# Altium schematic sheet DAC_SW_LEFT.SchDoc
size 381 x 241 mm
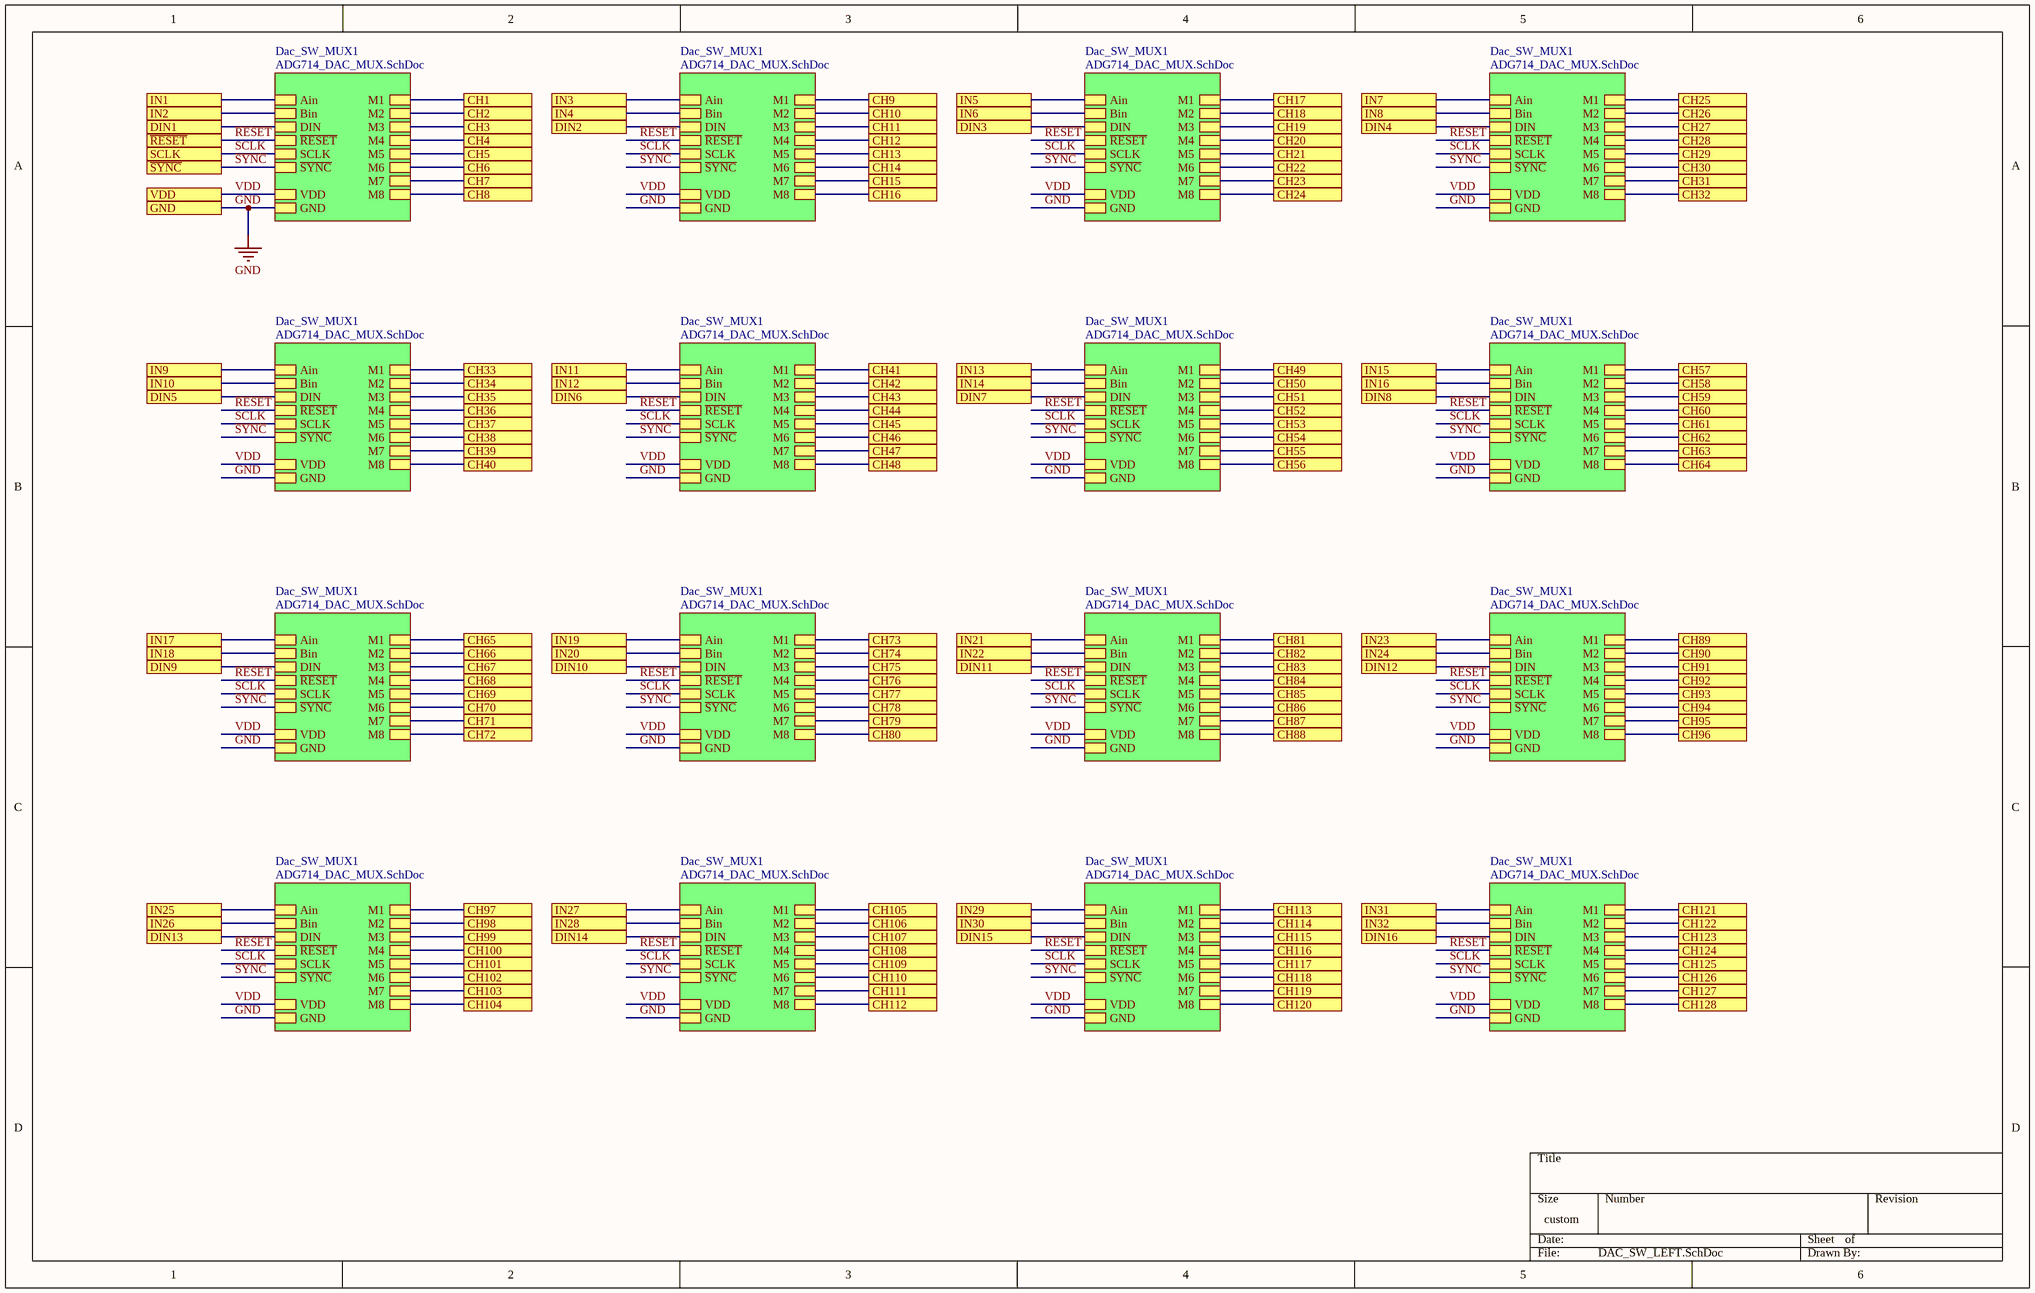
[diagram p0: DAC_SW_LEFT.SchDoc]

## Sub-sheets
Dac_SW_MUX1 = ADG714_DAC_MUX.SchDoc: M2, M7, M1, M6, M3, Bin, M5, VDD, GND, Ain, M8, M4, SCLK, ~{SYNC}, ~{RESET}, DIN
Dac_SW_MUX1 = ADG714_DAC_MUX.SchDoc: M2, M7, M1, M6, M3, Bin, M5, VDD, GND, Ain, M8, M4, SCLK, ~{SYNC}, ~{RESET}, DIN
Dac_SW_MUX1 = ADG714_DAC_MUX.SchDoc: M2, M7, M1, M6, M3, Bin, M5, VDD, GND, Ain, M8, M4, SCLK, ~{SYNC}, ~{RESET}, DIN
Dac_SW_MUX1 = ADG714_DAC_MUX.SchDoc: M2, M7, M1, M6, M3, Bin, M5, VDD, GND, Ain, M8, M4, SCLK, ~{SYNC}, ~{RESET}, DIN
Dac_SW_MUX1 = ADG714_DAC_MUX.SchDoc: M2, M7, M1, M6, M3, Bin, M5, VDD, GND, Ain, M8, M4, SCLK, ~{SYNC}, ~{RESET}, DIN
Dac_SW_MUX1 = ADG714_DAC_MUX.SchDoc: M2, M7, M1, M6, M3, Bin, M5, VDD, GND, Ain, M8, M4, SCLK, ~{SYNC}, ~{RESET}, DIN
Dac_SW_MUX1 = ADG714_DAC_MUX.SchDoc: M2, M7, M1, M6, M3, Bin, M5, VDD, GND, Ain, M8, M4, SCLK, ~{SYNC}, ~{RESET}, DIN
Dac_SW_MUX1 = ADG714_DAC_MUX.SchDoc: M2, M7, M1, M6, M3, Bin, M5, VDD, GND, Ain, M8, M4, SCLK, ~{SYNC}, ~{RESET}, DIN
Dac_SW_MUX1 = ADG714_DAC_MUX.SchDoc: M2, M7, M1, M6, M3, Bin, M5, VDD, GND, Ain, M8, M4, SCLK, ~{SYNC}, ~{RESET}, DIN
Dac_SW_MUX1 = ADG714_DAC_MUX.SchDoc: M2, M7, M1, M6, M3, Bin, M5, VDD, GND, Ain, M8, M4, SCLK, ~{SYNC}, ~{RESET}, DIN
Dac_SW_MUX1 = ADG714_DAC_MUX.SchDoc: M2, M7, M1, M6, M3, Bin, M5, VDD, GND, Ain, M8, M4, SCLK, ~{SYNC}, ~{RESET}, DIN
Dac_SW_MUX1 = ADG714_DAC_MUX.SchDoc: M2, M7, M1, M6, M3, Bin, M5, VDD, GND, Ain, M8, M4, SCLK, ~{SYNC}, ~{RESET}, DIN
Dac_SW_MUX1 = ADG714_DAC_MUX.SchDoc: M2, M7, M1, M6, M3, Bin, M5, VDD, GND, Ain, M8, M4, SCLK, ~{SYNC}, ~{RESET}, DIN
Dac_SW_MUX1 = ADG714_DAC_MUX.SchDoc: M2, M7, M1, M6, M3, Bin, M5, VDD, GND, Ain, M8, M4, SCLK, ~{SYNC}, ~{RESET}, DIN
Dac_SW_MUX1 = ADG714_DAC_MUX.SchDoc: M2, M7, M1, M6, M3, Bin, M5, VDD, GND, Ain, M8, M4, SCLK, ~{SYNC}, ~{RESET}, DIN
Dac_SW_MUX1 = ADG714_DAC_MUX.SchDoc: M2, M7, M1, M6, M3, Bin, M5, VDD, GND, Ain, M8, M4, SCLK, ~{SYNC}, ~{RESET}, DIN

## Ports
CH1, CH2, CH3, CH4, CH5, CH6, CH7, CH8, CH9, CH10, CH11, CH12, CH13, CH14, CH15, CH16, CH17, CH18, CH19, CH20, CH21, CH22, CH23, CH24, CH25, CH26, CH27, CH28, CH29, CH30, CH31, CH32, CH33, CH34, CH35, CH36, CH37, CH38, CH39, CH40, CH41, CH42, CH43, CH44, CH45, CH46, CH47, CH48, CH49, CH50, CH51, CH52, CH53, CH54, CH55, CH56, CH57, CH58, CH59, CH60, CH61, CH62, CH63, CH64, CH65, CH66, CH67, CH68, CH69, CH70, CH71, CH72, CH73, CH74, CH75, CH76, CH77, CH78, CH79, CH80, CH81, CH82, CH83, CH84, CH85, CH86, CH87, CH88, CH89, CH90, CH91, CH92, CH93, CH94, CH95, CH96, CH97, CH98, CH99, CH100, CH101, CH102, CH103, CH104, CH105, CH106, CH107, CH108, CH109, CH110, CH111, CH112, CH113, CH114, CH115, CH116, CH117, CH118, CH119, CH120, CH121, CH122, CH123, CH124, CH125, CH126, CH127, CH128, DIN1, DIN2, DIN3, DIN4, DIN5, DIN6, DIN7, DIN8, DIN9, DIN10, DIN11, DIN12, DIN13, DIN14, DIN15, DIN16, GND, IN1, IN2, IN3, IN4, IN5, IN6, IN7, IN8, IN9, IN10, IN11, IN12, IN13, IN14, IN15, IN16, IN17, IN18, IN19, IN20, IN21, IN22, IN23, IN24, IN25, IN26, IN27, IN28, IN29, IN30, IN31, IN32, SCLK, VDD, ~{RESET}, ~{SYNC}

## Nets
GND: port GND, sheet Dac_SW_MUX1/GND, sheet Dac_SW_MUX1/GND, sheet Dac_SW_MUX1/GND, sheet Dac_SW_MUX1/GND, sheet Dac_SW_MUX1/GND, sheet Dac_SW_MUX1/GND, sheet Dac_SW_MUX1/GND, sheet Dac_SW_MUX1/GND, sheet Dac_SW_MUX1/GND, sheet Dac_SW_MUX1/GND, sheet Dac_SW_MUX1/GND, sheet Dac_SW_MUX1/GND, sheet Dac_SW_MUX1/GND, sheet Dac_SW_MUX1/GND, sheet Dac_SW_MUX1/GND, sheet Dac_SW_MUX1/GND
CH1: port CH1, sheet Dac_SW_MUX1/M1
CH2: port CH2, sheet Dac_SW_MUX1/M2
CH3: port CH3, sheet Dac_SW_MUX1/M3
CH4: port CH4, sheet Dac_SW_MUX1/M4
CH5: port CH5, sheet Dac_SW_MUX1/M5
CH6: port CH6, sheet Dac_SW_MUX1/M6
CH7: port CH7, sheet Dac_SW_MUX1/M7
CH8: port CH8, sheet Dac_SW_MUX1/M8
CH9: port CH9, sheet Dac_SW_MUX1/M1
CH10: port CH10, sheet Dac_SW_MUX1/M2
CH11: port CH11, sheet Dac_SW_MUX1/M3
CH12: port CH12, sheet Dac_SW_MUX1/M4
CH13: port CH13, sheet Dac_SW_MUX1/M5
CH14: port CH14, sheet Dac_SW_MUX1/M6
CH15: port CH15, sheet Dac_SW_MUX1/M7
CH16: port CH16, sheet Dac_SW_MUX1/M8
CH17: port CH17, sheet Dac_SW_MUX1/M1
CH18: port CH18, sheet Dac_SW_MUX1/M2
CH19: port CH19, sheet Dac_SW_MUX1/M3
CH20: port CH20, sheet Dac_SW_MUX1/M4
CH21: port CH21, sheet Dac_SW_MUX1/M5
CH22: port CH22, sheet Dac_SW_MUX1/M6
CH23: port CH23, sheet Dac_SW_MUX1/M7
CH24: port CH24, sheet Dac_SW_MUX1/M8
CH25: port CH25, sheet Dac_SW_MUX1/M1
CH26: port CH26, sheet Dac_SW_MUX1/M2
CH27: port CH27, sheet Dac_SW_MUX1/M3
CH28: port CH28, sheet Dac_SW_MUX1/M4
CH29: port CH29, sheet Dac_SW_MUX1/M5
CH30: port CH30, sheet Dac_SW_MUX1/M6
CH31: port CH31, sheet Dac_SW_MUX1/M7
CH32: port CH32, sheet Dac_SW_MUX1/M8
CH33: port CH33, sheet Dac_SW_MUX1/M1
CH34: port CH34, sheet Dac_SW_MUX1/M2
CH35: port CH35, sheet Dac_SW_MUX1/M3
CH36: port CH36, sheet Dac_SW_MUX1/M4
CH37: port CH37, sheet Dac_SW_MUX1/M5
CH38: port CH38, sheet Dac_SW_MUX1/M6
CH39: port CH39, sheet Dac_SW_MUX1/M7
CH40: port CH40, sheet Dac_SW_MUX1/M8
CH41: port CH41, sheet Dac_SW_MUX1/M1
CH42: port CH42, sheet Dac_SW_MUX1/M2
CH43: port CH43, sheet Dac_SW_MUX1/M3
CH44: port CH44, sheet Dac_SW_MUX1/M4
CH45: port CH45, sheet Dac_SW_MUX1/M5
CH46: port CH46, sheet Dac_SW_MUX1/M6
CH47: port CH47, sheet Dac_SW_MUX1/M7
CH48: port CH48, sheet Dac_SW_MUX1/M8
CH49: port CH49, sheet Dac_SW_MUX1/M1
CH50: port CH50, sheet Dac_SW_MUX1/M2
CH51: port CH51, sheet Dac_SW_MUX1/M3
CH52: port CH52, sheet Dac_SW_MUX1/M4
CH53: port CH53, sheet Dac_SW_MUX1/M5
CH54: port CH54, sheet Dac_SW_MUX1/M6
CH55: port CH55, sheet Dac_SW_MUX1/M7
CH56: port CH56, sheet Dac_SW_MUX1/M8
CH57: port CH57, sheet Dac_SW_MUX1/M1
CH58: port CH58, sheet Dac_SW_MUX1/M2
CH59: port CH59, sheet Dac_SW_MUX1/M3
CH60: port CH60, sheet Dac_SW_MUX1/M4
CH61: port CH61, sheet Dac_SW_MUX1/M5
CH62: port CH62, sheet Dac_SW_MUX1/M6
CH63: port CH63, sheet Dac_SW_MUX1/M7
CH64: port CH64, sheet Dac_SW_MUX1/M8
CH65: port CH65, sheet Dac_SW_MUX1/M1
CH66: port CH66, sheet Dac_SW_MUX1/M2
CH67: port CH67, sheet Dac_SW_MUX1/M3
CH68: port CH68, sheet Dac_SW_MUX1/M4
CH69: port CH69, sheet Dac_SW_MUX1/M5
CH70: port CH70, sheet Dac_SW_MUX1/M6
CH71: port CH71, sheet Dac_SW_MUX1/M7
CH72: port CH72, sheet Dac_SW_MUX1/M8
CH73: port CH73, sheet Dac_SW_MUX1/M1
CH74: port CH74, sheet Dac_SW_MUX1/M2
CH75: port CH75, sheet Dac_SW_MUX1/M3
CH76: port CH76, sheet Dac_SW_MUX1/M4
CH77: port CH77, sheet Dac_SW_MUX1/M5
CH78: port CH78, sheet Dac_SW_MUX1/M6
CH79: port CH79, sheet Dac_SW_MUX1/M7
CH80: port CH80, sheet Dac_SW_MUX1/M8
CH81: port CH81, sheet Dac_SW_MUX1/M1
CH82: port CH82, sheet Dac_SW_MUX1/M2
CH83: port CH83, sheet Dac_SW_MUX1/M3
CH84: port CH84, sheet Dac_SW_MUX1/M4
CH85: port CH85, sheet Dac_SW_MUX1/M5
CH86: port CH86, sheet Dac_SW_MUX1/M6
CH87: port CH87, sheet Dac_SW_MUX1/M7
CH88: port CH88, sheet Dac_SW_MUX1/M8
CH89: port CH89, sheet Dac_SW_MUX1/M1
CH90: port CH90, sheet Dac_SW_MUX1/M2
CH91: port CH91, sheet Dac_SW_MUX1/M3
CH92: port CH92, sheet Dac_SW_MUX1/M4
CH93: port CH93, sheet Dac_SW_MUX1/M5
CH94: port CH94, sheet Dac_SW_MUX1/M6
CH95: port CH95, sheet Dac_SW_MUX1/M7
CH96: port CH96, sheet Dac_SW_MUX1/M8
CH97: port CH97, sheet Dac_SW_MUX1/M1
CH98: port CH98, sheet Dac_SW_MUX1/M2
CH99: port CH99, sheet Dac_SW_MUX1/M3
CH100: port CH100, sheet Dac_SW_MUX1/M4
CH101: port CH101, sheet Dac_SW_MUX1/M5
CH102: port CH102, sheet Dac_SW_MUX1/M6
CH103: port CH103, sheet Dac_SW_MUX1/M7
CH104: port CH104, sheet Dac_SW_MUX1/M8
CH105: port CH105, sheet Dac_SW_MUX1/M1
CH106: port CH106, sheet Dac_SW_MUX1/M2
CH107: port CH107, sheet Dac_SW_MUX1/M3
CH108: port CH108, sheet Dac_SW_MUX1/M4
CH109: port CH109, sheet Dac_SW_MUX1/M5
CH110: port CH110, sheet Dac_SW_MUX1/M6
CH111: port CH111, sheet Dac_SW_MUX1/M7
CH112: port CH112, sheet Dac_SW_MUX1/M8
CH113: port CH113, sheet Dac_SW_MUX1/M1
CH114: port CH114, sheet Dac_SW_MUX1/M2
CH115: port CH115, sheet Dac_SW_MUX1/M3
CH116: port CH116, sheet Dac_SW_MUX1/M4
CH117: port CH117, sheet Dac_SW_MUX1/M5
CH118: port CH118, sheet Dac_SW_MUX1/M6
CH119: port CH119, sheet Dac_SW_MUX1/M7
CH120: port CH120, sheet Dac_SW_MUX1/M8
CH121: port CH121, sheet Dac_SW_MUX1/M1
CH122: port CH122, sheet Dac_SW_MUX1/M2
CH123: port CH123, sheet Dac_SW_MUX1/M3
CH124: port CH124, sheet Dac_SW_MUX1/M4
CH125: port CH125, sheet Dac_SW_MUX1/M5
CH126: port CH126, sheet Dac_SW_MUX1/M6
CH127: port CH127, sheet Dac_SW_MUX1/M7
CH128: port CH128, sheet Dac_SW_MUX1/M8
DIN1: port DIN1, sheet Dac_SW_MUX1/DIN
DIN2: port DIN2, sheet Dac_SW_MUX1/DIN
DIN3: port DIN3, sheet Dac_SW_MUX1/DIN
DIN4: port DIN4, sheet Dac_SW_MUX1/DIN
DIN5: port DIN5, sheet Dac_SW_MUX1/DIN
DIN6: port DIN6, sheet Dac_SW_MUX1/DIN
DIN7: port DIN7, sheet Dac_SW_MUX1/DIN
DIN8: port DIN8, sheet Dac_SW_MUX1/DIN
DIN9: port DIN9, sheet Dac_SW_MUX1/DIN
DIN10: port DIN10, sheet Dac_SW_MUX1/DIN
DIN11: port DIN11, sheet Dac_SW_MUX1/DIN
DIN12: port DIN12, sheet Dac_SW_MUX1/DIN
DIN13: port DIN13, sheet Dac_SW_MUX1/DIN
DIN14: port DIN14, sheet Dac_SW_MUX1/DIN
DIN15: port DIN15, sheet Dac_SW_MUX1/DIN
DIN16: port DIN16, sheet Dac_SW_MUX1/DIN
IN1: port IN1, sheet Dac_SW_MUX1/Ain
IN2: port IN2, sheet Dac_SW_MUX1/Bin
IN3: port IN3, sheet Dac_SW_MUX1/Ain
IN4: port IN4, sheet Dac_SW_MUX1/Bin
IN5: port IN5, sheet Dac_SW_MUX1/Ain
IN6: port IN6, sheet Dac_SW_MUX1/Bin
IN7: port IN7, sheet Dac_SW_MUX1/Ain
IN8: port IN8, sheet Dac_SW_MUX1/Bin
IN9: port IN9, sheet Dac_SW_MUX1/Ain
IN10: port IN10, sheet Dac_SW_MUX1/Bin
IN11: port IN11, sheet Dac_SW_MUX1/Ain
IN12: port IN12, sheet Dac_SW_MUX1/Bin
IN13: port IN13, sheet Dac_SW_MUX1/Ain
IN14: port IN14, sheet Dac_SW_MUX1/Bin
IN15: port IN15, sheet Dac_SW_MUX1/Ain
IN16: port IN16, sheet Dac_SW_MUX1/Bin
IN17: port IN17, sheet Dac_SW_MUX1/Ain
IN18: port IN18, sheet Dac_SW_MUX1/Bin
IN19: port IN19, sheet Dac_SW_MUX1/Ain
IN20: port IN20, sheet Dac_SW_MUX1/Bin
IN21: port IN21, sheet Dac_SW_MUX1/Ain
IN22: port IN22, sheet Dac_SW_MUX1/Bin
IN23: port IN23, sheet Dac_SW_MUX1/Ain
IN24: port IN24, sheet Dac_SW_MUX1/Bin
IN25: port IN25, sheet Dac_SW_MUX1/Ain
IN26: port IN26, sheet Dac_SW_MUX1/Bin
IN27: port IN27, sheet Dac_SW_MUX1/Ain
IN28: port IN28, sheet Dac_SW_MUX1/Bin
IN29: port IN29, sheet Dac_SW_MUX1/Ain
IN30: port IN30, sheet Dac_SW_MUX1/Bin
IN31: port IN31, sheet Dac_SW_MUX1/Ain
IN32: port IN32, sheet Dac_SW_MUX1/Bin
~{RESET}: port ~{RESET}, sheet Dac_SW_MUX1/~{RESET}, sheet Dac_SW_MUX1/~{RESET}, sheet Dac_SW_MUX1/~{RESET}, sheet Dac_SW_MUX1/~{RESET}, sheet Dac_SW_MUX1/~{RESET}, sheet Dac_SW_MUX1/~{RESET}, sheet Dac_SW_MUX1/~{RESET}, sheet Dac_SW_MUX1/~{RESET}, sheet Dac_SW_MUX1/~{RESET}, sheet Dac_SW_MUX1/~{RESET}, sheet Dac_SW_MUX1/~{RESET}, sheet Dac_SW_MUX1/~{RESET}, sheet Dac_SW_MUX1/~{RESET}, sheet Dac_SW_MUX1/~{RESET}, sheet Dac_SW_MUX1/~{RESET}, sheet Dac_SW_MUX1/~{RESET}
~{SYNC}: port ~{SYNC}, sheet Dac_SW_MUX1/~{SYNC}, sheet Dac_SW_MUX1/~{SYNC}, sheet Dac_SW_MUX1/~{SYNC}, sheet Dac_SW_MUX1/~{SYNC}, sheet Dac_SW_MUX1/~{SYNC}, sheet Dac_SW_MUX1/~{SYNC}, sheet Dac_SW_MUX1/~{SYNC}, sheet Dac_SW_MUX1/~{SYNC}, sheet Dac_SW_MUX1/~{SYNC}, sheet Dac_SW_MUX1/~{SYNC}, sheet Dac_SW_MUX1/~{SYNC}, sheet Dac_SW_MUX1/~{SYNC}, sheet Dac_SW_MUX1/~{SYNC}, sheet Dac_SW_MUX1/~{SYNC}, sheet Dac_SW_MUX1/~{SYNC}, sheet Dac_SW_MUX1/~{SYNC}
SCLK: port SCLK, sheet Dac_SW_MUX1/SCLK, sheet Dac_SW_MUX1/SCLK, sheet Dac_SW_MUX1/SCLK, sheet Dac_SW_MUX1/SCLK, sheet Dac_SW_MUX1/SCLK, sheet Dac_SW_MUX1/SCLK, sheet Dac_SW_MUX1/SCLK, sheet Dac_SW_MUX1/SCLK, sheet Dac_SW_MUX1/SCLK, sheet Dac_SW_MUX1/SCLK, sheet Dac_SW_MUX1/SCLK, sheet Dac_SW_MUX1/SCLK, sheet Dac_SW_MUX1/SCLK, sheet Dac_SW_MUX1/SCLK, sheet Dac_SW_MUX1/SCLK, sheet Dac_SW_MUX1/SCLK
VDD: port VDD, sheet Dac_SW_MUX1/VDD, sheet Dac_SW_MUX1/VDD, sheet Dac_SW_MUX1/VDD, sheet Dac_SW_MUX1/VDD, sheet Dac_SW_MUX1/VDD, sheet Dac_SW_MUX1/VDD, sheet Dac_SW_MUX1/VDD, sheet Dac_SW_MUX1/VDD, sheet Dac_SW_MUX1/VDD, sheet Dac_SW_MUX1/VDD, sheet Dac_SW_MUX1/VDD, sheet Dac_SW_MUX1/VDD, sheet Dac_SW_MUX1/VDD, sheet Dac_SW_MUX1/VDD, sheet Dac_SW_MUX1/VDD, sheet Dac_SW_MUX1/VDD